# Altium project Regulators.PrjPcb
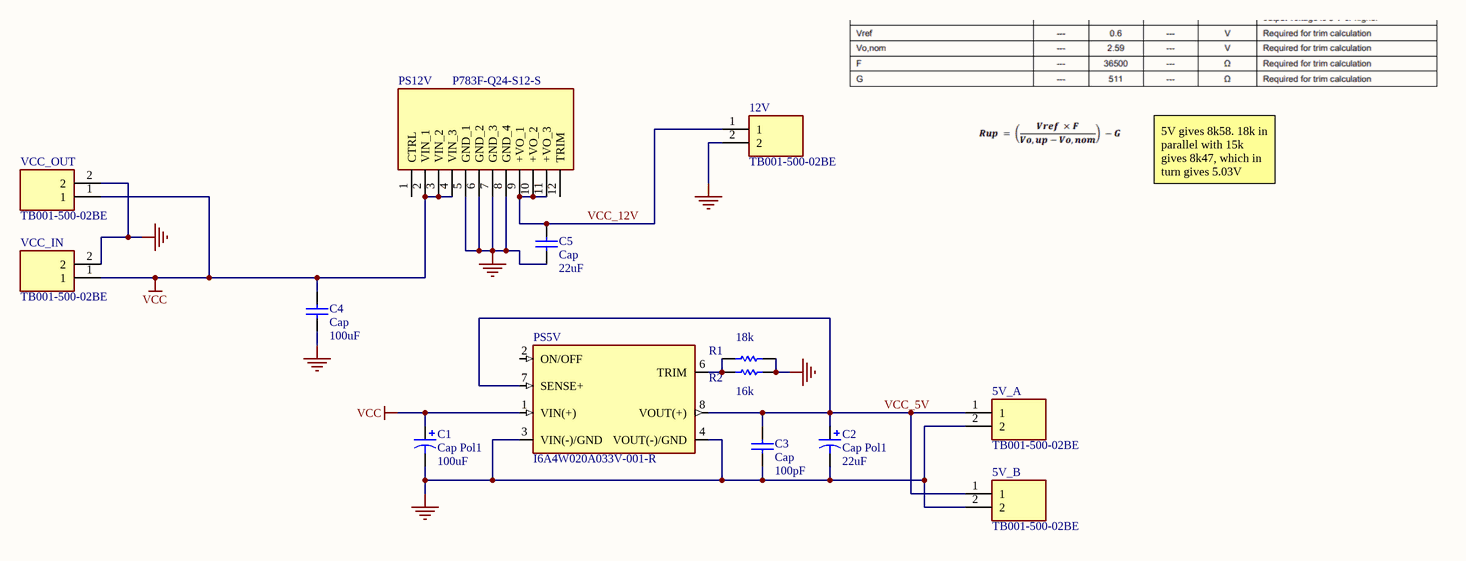
[diagram p0: Regulators.SchDoc]
2 sheets, 22 parts. Net scope: global (net labels, ports and power ports of the same name join across sheets).
Board files: PCB Other.PcbDoc, PCB 24V.PcbDoc
Sheets:
  Regulators.SchDoc
  Motor_regulators.SchDoc

## Sheet Regulators.SchDoc
size A4

### Parts
(Parts that share a designator on the sheet are numbered #1, #2 ... from top to bottom, then left to right.)
5V_A  TB001-500-02BE  [TB00150002BE]
5V_B  TB001-500-02BE  [TB00150002BE]
12V  TB001-500-02BE  [TB00150002BE]
C1  Cap Pol1  value 100uF  [RB7.6-15]
C2  Cap Pol1  value 22uF  [RB7.6-15]
C3  Cap  value 100pF  [RAD-0.3]
C4  Cap  value 100uF  [RAD-0.3]
C5  Cap  value 22uF  [RAD-0.3]
PS5V  I6A4W020A033V-001-R  [TDK-LAMBDA_I6A4W020A033V-001-R]
PS12V  P783F-Q24-S12-S  [P783FQ24S12S]
R1  value 18k  [AXIAL-0.3]  (hidden comment: Rup)
R2  value 16k  [AXIAL-0.3]  (hidden comment: Rup)
VCC_IN#1  TB001-500-02BE  [TB00150002BE]
VCC_OUT#1  TB001-500-02BE  [TB00150002BE]

### Nets
GND: 5V_A.2 5V_B.2 12V.2 C1.2 C2.2 C3.1 C4.1 C5.1 PS5V.3(VIN(-)/GND) PS5V.4(VOUT(-)/GND) PS12V.5(GND_1) PS12V.6(GND_2) PS12V.7(GND_3) PS12V.8(GND_4) R1.2 R2.2 VCC_IN#1.2 VCC_OUT#1.2
VCC: C1.1 C4.2 PS5V.1(VIN(+)) PS12V.2(VIN_1) PS12V.3(VIN_2) PS12V.4(VIN_3) VCC_IN#1.1 VCC_OUT#1.1
VCC_5V: 5V_A.1 5V_B.1 C2.1 C3.2 PS5V.7(SENSE+) PS5V.8(VOUT(+))
VCC_12V: 12V.1 C5.2 PS12V.9(+VO_1) PS12V.10(+VO_2) PS12V.11(+VO_3)
NetPS5V_6: PS5V.6(TRIM) R1.1 R2.1

Not connected (* = marked no-connect by the designer): PS5V 2(ON/OFF); PS12V 1(CTRL) 12(TRIM)

### Notes on the sheet
- 5V gives 8k58. 18k in parallel with 15k gives 8k47, which in turn gives 5.03V

### Library data of the parts
5V_A 5V_B 12V VCC_IN#1 VCC_OUT#1 = TB001-500-02BE: Integrated Circuit; Manufacturer_Name: CUI Inc.; Datasheet Link: https://componentsearchengine.com//TB001-500-02BE.pdf; Height: 12.9mm; Mouser2 Part Number: 490-TB001-500-02BE; Mouser2 Price/Stock: https://www.mouser.com/Search/Refine.aspx?Keyword=490-TB001-500-02BE; Manufacturer_Part_Number: TB001-500-02BE
C1 C2 = Cap Pol1: Polarized Capacitor (Radial); Published: 8-Jun-2000; LatestRevisionDate: 17-Jul-2002; LatestRevisionNote: Re-released for DXP Platform.; PackageReference: RB7.6-15; Publisher: Altium Limited; PackageDescription: Polarized Capacitor (Radial); 2 Leads
C3-C5 = Cap: Capacitor; Published: 8-Jun-2000; LatestRevisionDate: 17-Jul-2002; LatestRevisionNote: Re-released for DXP Platform.; PackageReference: RAD-0.3; Publisher: Altium Limited; PackageDescription: Radial Cap, Thru-Hole; 2 Leads; 0.3 in Pin Spacing
PS5V = I6A4W020A033V-001-R: Non-Isolated PoL Module DC DC Converter 1 Output 3.3 ~ 15V 20A 9V - 53V Input; MF: TDK-Lambda Americas; MP: I6A4W020A033V-001-R; Value: *; Digi-Key_Purchase_URL: https://www.digikey.com/product-detail/en/tdk-lambda-americas-inc/I6A4W020A033V-001-R/285-2503-ND/5878834?utm_source=snapeda&utm_medium=aggregator&utm_campaign=symbol; SnapEDA_Link: https://www.snapeda.com/parts/I6A4W020A033V-001-R/TDK-Lambda%20Americas%20Inc./view-part/1737324/?ref=snap; Digi-Key_Part_Number: 285-2503-ND; Package: DIP-7 TDK-Lambda
PS12V = P783F-Q24-S12-S: Power Supply; Manufacturer_Name: CUI Inc.; Datasheet Link: https://www.cui.com/product/resource/p783f-s.pdf; Height: 13mm; Manufacturer_Part_Number: P783F-Q24-S12-S
R1 R2 = Res1: Resistor; Published: 8-Jun-2000; LatestRevisionDate: 17-Jul-2002; LatestRevisionNote: Re-released for DXP Platform.; PackageReference: AXIAL-0.3; Publisher: Altium Limited; PackageDescription: Axial Device, Thru-Hole; 2 Leads; 0.3 in Pin Spacing

## Sheet Motor_regulators.SchDoc
size A4
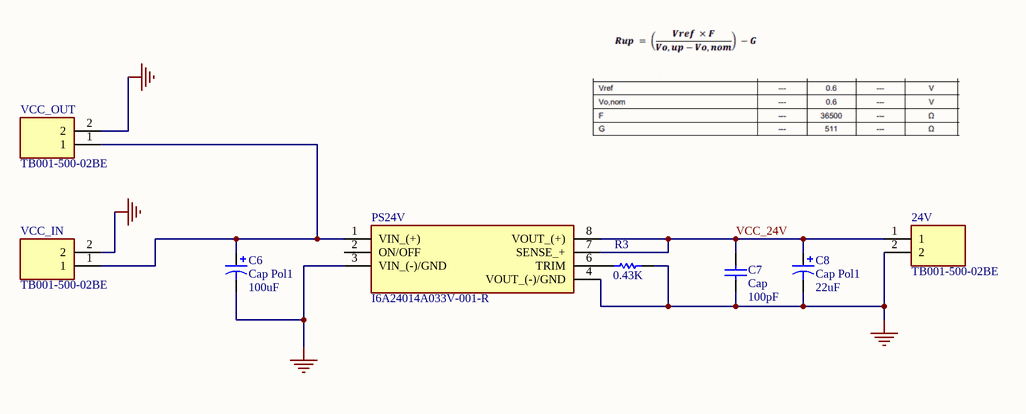
[diagram p1: Motor_regulators.SchDoc]

### Parts
(Parts that share a designator on the sheet are numbered #1, #2 ... from top to bottom, then left to right.)
24V  TB001-500-02BE  [TB00150002BE]
C6  Cap Pol1  value 100uF  [RB7.6-15]
C7  Cap  value 100pF  [RAD-0.3]
C8  Cap Pol1  value 22uF  [RB7.6-15]
PS24V  I6A24014A033V-001-R  [I6A24014A033V001R]
R3  value 0.43K  [AXIAL-0.3]  (hidden comment: Res1)
VCC_IN#2  TB001-500-02BE  [TB00150002BE]
VCC_OUT#2  TB001-500-02BE  [TB00150002BE]

### Nets
GND: 24V.2 C6.2 C7.1 C8.2 PS24V.3(VIN_(-)/GND) PS24V.4(VOUT_(-)/GND) R3.1 VCC_IN#2.2 VCC_OUT#2.2
VCC_24V: 24V.1 C7.2 C8.1 PS24V.7(SENSE_+) PS24V.8(VOUT_(+))
NetC6_1: C6.1 PS24V.1(VIN_(+)) VCC_IN#2.1 VCC_OUT#2.1
NetPS24V_6: PS24V.6(TRIM) R3.2

Not connected (* = marked no-connect by the designer): PS24V 2(ON/OFF)

### Library data of the parts
24V VCC_IN#2 VCC_OUT#2 = TB001-500-02BE: as 5V_A on sheet Regulators; Datasheet Link: https://componentsearchengine.com//TB001-500-02BE.pdf; Height: 12.9mm; Mouser2 Part Number: 490-TB001-500-02BE; Mouser2 Price/Stock: https://www.mouser.com/Search/Refine.aspx?Keyword=490-TB001-500-02BE; Manufacturer_Part_Number: TB001-500-02BE
C6 C8 = Cap Pol1: Polarized Capacitor (Radial); Published: 8-Jun-2000; LatestRevisionDate: 17-Jul-2002; LatestRevisionNote: Re-released for DXP Platform.; PackageReference: RB7.6-15; Publisher: Altium Limited; PackageDescription: Polarized Capacitor (Radial); 2 Leads
C7 = Cap: Capacitor; Published: 8-Jun-2000; LatestRevisionDate: 17-Jul-2002; LatestRevisionNote: Re-released for DXP Platform.; PackageReference: RAD-0.3; Publisher: Altium Limited; PackageDescription: Radial Cap, Thru-Hole; 2 Leads; 0.3 in Pin Spacing
PS24V = I6A24014A033V-001-R: Power Supply; Manufacturer_Name: TDK; Datasheet Link: https://componentsearchengine.com//I6A24014A033V-001-R.pdf; Height: 12.1mm; Mouser2 Part Number: 967-I6A24014A033V001; Mouser2 Price/Stock: https://www.mouser.com/Search/Refine.aspx?Keyword=967-I6A24014A033V001; Manufacturer_Part_Number: I6A24014A033V-001-R
R3 = Res1: Resistor; Published: 8-Jun-2000; LatestRevisionDate: 17-Jul-2002; LatestRevisionNote: Re-released for DXP Platform.; PackageReference: AXIAL-0.3; Publisher: Altium Limited; PackageDescription: Axial Device, Thru-Hole; 2 Leads; 0.3 in Pin Spacing

## Nets that join several sheets
GND: Regulators (18 pins), Motor_regulators (9 pins)